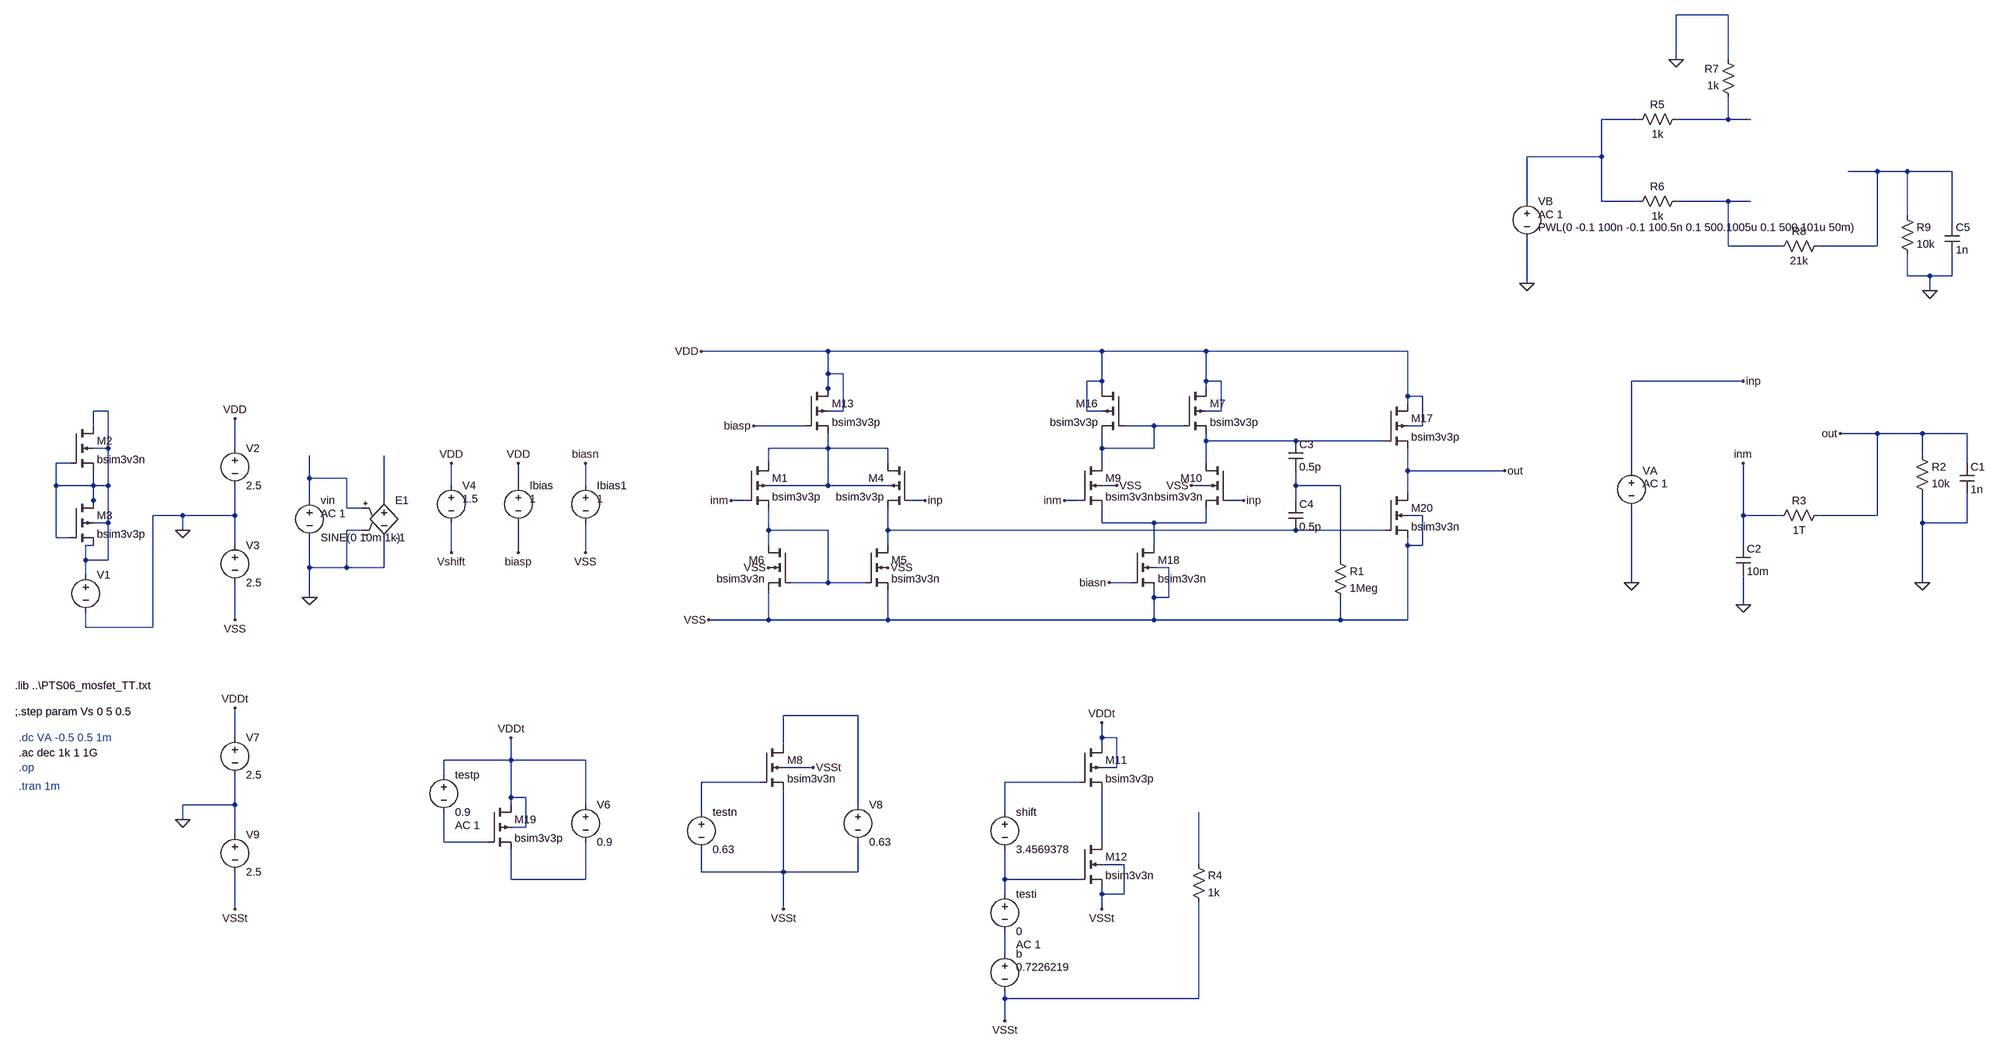
[diagram p0: schematic railtorail.asc]
railtorail.asc, the LTspice schematic file:
Version 4
SHEET 1 4152 812
WIRE 3392 -1520 3280 -1520
WIRE 3280 -1424 3280 -1520
WIRE 3392 -1424 3392 -1520
WIRE 3200 -1296 3120 -1296
WIRE 3392 -1296 3392 -1344
WIRE 3392 -1296 3280 -1296
WIRE 3440 -1296 3392 -1296
WIRE 3120 -1216 3120 -1296
WIRE 3120 -1216 2960 -1216
WIRE 3712 -1184 3648 -1184
WIRE 3776 -1184 3712 -1184
WIRE 3872 -1184 3776 -1184
WIRE 2960 -1120 2960 -1216
WIRE 3120 -1120 3120 -1216
WIRE 3200 -1120 3120 -1120
WIRE 3392 -1120 3280 -1120
WIRE 3440 -1120 3392 -1120
WIRE 3776 -1088 3776 -1184
WIRE 3872 -1072 3872 -1184
WIRE 3392 -1024 3392 -1120
WIRE 3504 -1024 3392 -1024
WIRE 3712 -1024 3712 -1184
WIRE 3712 -1024 3584 -1024
WIRE 3776 -960 3776 -1008
WIRE 3824 -960 3776 -960
WIRE 3872 -960 3872 -1008
WIRE 3872 -960 3824 -960
WIRE 2960 -944 2960 -1040
WIRE 3824 -928 3824 -960
WIRE 1376 -768 1104 -768
WIRE 2048 -768 1376 -768
WIRE 2272 -768 2048 -768
WIRE 2704 -768 2272 -768
WIRE 1376 -720 1376 -768
WIRE 1408 -720 1376 -720
WIRE 2048 -704 2048 -768
WIRE 2048 -704 2016 -704
WIRE 2272 -704 2272 -768
WIRE 2304 -704 2272 -704
WIRE 3424 -704 3184 -704
WIRE 1376 -688 1376 -720
WIRE 2048 -688 2048 -704
WIRE 2272 -688 2272 -704
WIRE 1376 -672 1376 -688
WIRE 2704 -672 2704 -768
WIRE 2736 -672 2704 -672
WIRE 2704 -656 2704 -672
WIRE -320 -640 -352 -640
WIRE 1408 -640 1408 -720
WIRE 1408 -640 1376 -640
WIRE 2016 -640 2016 -704
WIRE 2048 -640 2016 -640
WIRE 2304 -640 2304 -704
WIRE 2304 -640 2272 -640
WIRE -352 -608 -352 -640
WIRE 1328 -608 1216 -608
WIRE 2160 -608 2096 -608
WIRE 2224 -608 2160 -608
WIRE 2736 -608 2736 -672
WIRE 2736 -608 2704 -608
WIRE 3712 -592 3632 -592
WIRE 3808 -592 3712 -592
WIRE 3904 -592 3808 -592
WIRE 2272 -576 2272 -592
WIRE 2464 -576 2272 -576
WIRE 2656 -576 2464 -576
WIRE -320 -560 -320 -640
WIRE -320 -560 -352 -560
WIRE -48 -560 -48 -624
WIRE 1376 -560 1376 -592
WIRE 1376 -560 1248 -560
WIRE 1504 -560 1376 -560
WIRE 2048 -560 2048 -592
WIRE 2160 -560 2160 -608
WIRE 2160 -560 2048 -560
WIRE 3808 -544 3808 -592
WIRE -400 -528 -432 -528
WIRE 1248 -528 1248 -560
WIRE 1504 -528 1504 -560
WIRE 2048 -528 2048 -560
WIRE 2272 -528 2272 -576
WIRE 3904 -528 3904 -592
WIRE 2704 -512 2704 -560
WIRE 2912 -512 2704 -512
WIRE 3184 -512 3184 -704
WIRE 112 -496 112 -544
WIRE 192 -496 112 -496
WIRE -432 -480 -432 -528
WIRE -352 -480 -352 -512
WIRE -352 -480 -432 -480
WIRE -320 -480 -320 -560
WIRE -320 -480 -352 -480
WIRE 416 -480 416 -528
WIRE 560 -480 560 -528
WIRE 704 -480 704 -528
WIRE 1376 -480 1376 -560
WIRE 1376 -480 1248 -480
WIRE 1504 -480 1376 -480
WIRE 2080 -480 2048 -480
WIRE 2272 -480 2240 -480
WIRE 2464 -480 2464 -512
WIRE 2560 -480 2464 -480
WIRE 2704 -464 2704 -512
WIRE -352 -448 -352 -480
WIRE 112 -448 112 -496
WIRE 272 -448 272 -544
WIRE 1200 -448 1168 -448
WIRE 1584 -448 1552 -448
WIRE 2000 -448 1968 -448
WIRE 2352 -448 2320 -448
WIRE 2464 -448 2464 -480
WIRE -352 -432 -352 -448
WIRE 192 -432 192 -496
WIRE 224 -432 192 -432
WIRE -160 -416 -224 -416
WIRE -48 -416 -48 -480
WIRE -48 -416 -160 -416
WIRE 2736 -416 2704 -416
WIRE 3424 -416 3424 -528
WIRE 3504 -416 3424 -416
WIRE 3712 -416 3712 -592
WIRE 3712 -416 3584 -416
WIRE -320 -400 -320 -480
WIRE -320 -400 -352 -400
WIRE 2048 -400 2048 -432
WIRE 2160 -400 2048 -400
WIRE 2272 -400 2272 -432
WIRE 2272 -400 2160 -400
WIRE 3808 -400 3808 -464
WIRE 3904 -400 3904 -464
WIRE 3904 -400 3808 -400
WIRE -160 -384 -160 -416
WIRE 224 -384 192 -384
WIRE 1248 -384 1248 -432
WIRE 1376 -384 1248 -384
WIRE 1504 -384 1504 -432
WIRE 2464 -384 1504 -384
WIRE 2656 -384 2464 -384
WIRE -432 -368 -432 -480
WIRE -400 -368 -432 -368
WIRE -352 -352 -368 -352
WIRE -48 -352 -48 -416
WIRE 1248 -352 1248 -384
WIRE 1504 -352 1504 -384
WIRE 2160 -352 2160 -400
WIRE 2704 -352 2704 -368
WIRE 2736 -352 2736 -416
WIRE 2736 -352 2704 -352
WIRE 3424 -352 3424 -416
WIRE 416 -336 416 -400
WIRE 560 -336 560 -400
WIRE 704 -336 704 -400
WIRE -368 -320 -368 -352
WIRE -320 -320 -320 -400
WIRE -320 -320 -368 -320
WIRE 2560 -320 2560 -480
WIRE 112 -304 112 -368
WIRE 192 -304 192 -384
WIRE 192 -304 112 -304
WIRE 272 -304 272 -368
WIRE 272 -304 192 -304
WIRE 2192 -304 2160 -304
WIRE -368 -288 -368 -320
WIRE 1376 -272 1376 -384
WIRE 1376 -272 1296 -272
WIRE 1456 -272 1376 -272
WIRE 2112 -272 2064 -272
WIRE 3184 -272 3184 -432
WIRE 3808 -272 3808 -400
WIRE 112 -240 112 -304
WIRE 2160 -240 2160 -256
WIRE 2192 -240 2192 -304
WIRE 2192 -240 2160 -240
WIRE 3424 -224 3424 -288
WIRE -48 -192 -48 -272
WIRE 1248 -192 1248 -256
WIRE 1248 -192 1120 -192
WIRE 1504 -192 1504 -256
WIRE 1504 -192 1248 -192
WIRE 2160 -192 2160 -240
WIRE 2160 -192 1504 -192
WIRE 2560 -192 2560 -240
WIRE 2560 -192 2160 -192
WIRE 2704 -192 2704 -352
WIRE 2704 -192 2560 -192
WIRE -368 -176 -368 -208
WIRE -224 -176 -224 -416
WIRE -224 -176 -368 -176
WIRE 1440 48 1280 48
WIRE -48 96 -48 32
WIRE 2048 96 2048 64
WIRE 2080 96 2048 96
WIRE 1280 112 1280 48
WIRE 2048 112 2048 96
WIRE 544 144 544 96
WIRE 544 144 400 144
WIRE 704 144 544 144
WIRE 1344 160 1280 160
WIRE 2080 160 2080 96
WIRE 2080 160 2048 160
WIRE 400 176 400 144
WIRE 1232 192 1104 192
WIRE 2000 192 1840 192
WIRE 544 224 544 144
WIRE 576 224 544 224
WIRE -48 240 -48 176
WIRE -48 240 -160 240
WIRE 544 240 544 224
WIRE 704 240 704 144
WIRE 1440 240 1440 48
WIRE 1104 256 1104 192
WIRE 1840 256 1840 192
WIRE -160 272 -160 240
WIRE 576 288 576 224
WIRE 576 288 544 288
WIRE -48 304 -48 240
WIRE 400 320 400 256
WIRE 496 320 400 320
WIRE 2048 320 2048 208
WIRE 2096 368 2048 368
WIRE 2256 368 2256 256
WIRE 1104 384 1104 336
WIRE 1280 384 1280 208
WIRE 1280 384 1104 384
WIRE 1440 384 1440 320
WIRE 1440 384 1280 384
WIRE 544 400 544 336
WIRE 704 400 704 320
WIRE 704 400 544 400
WIRE 1840 400 1840 336
WIRE 2000 400 1840 400
WIRE 1840 432 1840 400
WIRE 2048 432 2048 416
WIRE 2096 432 2096 368
WIRE 2096 432 2048 432
WIRE -48 464 -48 384
WIRE 1280 464 1280 384
WIRE 2048 464 2048 432
WIRE 1840 560 1840 512
WIRE 1840 656 1840 640
WIRE 2256 656 2256 448
WIRE 2256 656 1840 656
WIRE 1840 704 1840 656
FLAG -160 -384 0
FLAG -48 -192 VSS
FLAG -48 -624 VDD
FLAG 112 -240 0
FLAG 1248 -304 VSS
FLAG 1504 -304 VSS
FLAG 1120 -192 VSS
FLAG 1104 -768 VDD
FLAG 1584 -448 inp
FLAG 1168 -448 inm
FLAG 416 -528 VDD
FLAG 416 -336 Vshift
FLAG 2912 -512 out
FLAG 560 -528 VDD
FLAG 560 -336 biasp
FLAG 1216 -608 biasp
FLAG 2048 464 VSSt
FLAG 2048 64 VDDt
FLAG 1840 704 VSSt
FLAG 2080 -480 VSS
FLAG 2240 -480 VSS
FLAG 704 -336 VSS
FLAG 704 -528 biasn
FLAG 2064 -272 biasn
FLAG 1968 -448 inm
FLAG 2352 -448 inp
FLAG 1344 160 VSSt
FLAG 1280 464 VSSt
FLAG 544 96 VDDt
FLAG 3424 -704 inp
FLAG 3424 -528 inm
FLAG 3632 -592 out
FLAG 3184 -272 0
FLAG 3808 -272 0
FLAG 3424 -224 0
FLAG -160 272 0
FLAG -48 464 VSSt
FLAG -48 32 VDDt
FLAG 3280 -1424 0
FLAG 3824 -928 0
FLAG 2960 -944 0
DATAFLAG 1360 -384 ""
DATAFLAG 1344 -560 ""
DATAFLAG 1648 -384 ""
DATAFLAG 2576 -576 ""
DATAFLAG 2800 -512 ""
DATAFLAG 1696 -192 ""
DATAFLAG 1664 -768 ""
DATAFLAG 2160 -400 ""
SYMBOL nmos4 -400 -608 R0
SYMATTR InstName M2
SYMATTR Value bsim3v3n
SYMATTR Value2 l=0.6u w=1.2u
SYMBOL pmos4 -400 -448 R0
SYMATTR InstName M3
SYMATTR Value bsim3v3p
SYMATTR Value2 l=0.6u w=1.2u
SYMBOL voltage -368 -304 R0
WINDOW 123 0 0 Left 0
WINDOW 39 0 0 Left 0
SYMATTR InstName V1
SYMATTR Value ""
SYMBOL voltage -48 -576 R0
WINDOW 123 0 0 Left 0
WINDOW 39 0 0 Left 0
SYMATTR InstName V2
SYMATTR Value 2.5
SYMBOL voltage -48 -368 R0
WINDOW 123 0 0 Left 0
WINDOW 39 0 0 Left 0
SYMATTR InstName V3
SYMATTR Value 2.5
SYMBOL voltage 112 -464 R0
WINDOW 123 24 44 Left 2
WINDOW 39 0 0 Left 0
SYMATTR Value2 AC 1
SYMATTR InstName vin
SYMATTR Value SINE(0 10m 1k)
SYMBOL e 272 -464 R0
SYMATTR InstName E1
SYMATTR Value -1
SYMBOL voltage 416 -496 R0
WINDOW 123 0 0 Left 0
WINDOW 39 0 0 Left 0
WINDOW 3 24 44 Left 2
SYMATTR Value 1.5
SYMATTR InstName V4
SYMBOL voltage 400 160 R0
WINDOW 123 24 124 Left 2
WINDOW 39 0 0 Left 0
SYMATTR Value2 AC 1
SYMATTR InstName testp
SYMATTR Value 0.9
SYMBOL voltage 704 224 R0
WINDOW 123 0 0 Left 0
WINDOW 39 0 0 Left 0
SYMATTR InstName V6
SYMATTR Value 0.9
SYMBOL voltage 1104 240 R0
WINDOW 123 0 0 Left 0
WINDOW 39 0 0 Left 0
SYMATTR InstName testn
SYMATTR Value 0.63
SYMBOL voltage 1440 224 R0
WINDOW 123 0 0 Left 0
WINDOW 39 0 0 Left 0
SYMATTR InstName V8
SYMATTR Value 0.63
SYMBOL voltage 560 -496 R0
WINDOW 123 0 0 Left 0
WINDOW 39 0 0 Left 0
WINDOW 3 24 44 Left 2
SYMATTR Value 1
SYMATTR InstName Ibias
SYMBOL voltage 1840 240 R0
WINDOW 123 0 0 Left 0
WINDOW 39 0 0 Left 0
SYMATTR InstName shift
SYMATTR Value 3.4569378
SYMBOL voltage 1840 416 R0
WINDOW 123 24 124 Left 2
WINDOW 39 0 0 Left 0
SYMATTR Value2 AC 1
SYMATTR InstName testi
SYMATTR Value 0
SYMBOL voltage 1840 544 R0
WINDOW 123 0 0 Left 0
WINDOW 39 0 0 Left 0
WINDOW 3 24 44 Left 2
SYMATTR Value 0.7226219
SYMATTR InstName b
SYMBOL voltage 704 -496 R0
WINDOW 123 0 0 Left 0
WINDOW 39 0 0 Left 0
WINDOW 3 24 44 Left 2
SYMATTR Value 1
SYMATTR InstName Ibias1
SYMBOL nmos4 2000 -528 R0
SYMATTR InstName M9
SYMATTR Value bsim3v3n
SYMATTR Value2 l=0.6u w=1.2u m=4
SYMBOL nmos4 2320 -528 M0
SYMATTR InstName M10
SYMATTR Value bsim3v3n
SYMATTR Value2 l=0.6u w=1.2u m=4
SYMBOL nmos4 2112 -352 R0
SYMATTR InstName M18
SYMATTR Value bsim3v3n
SYMATTR Value2 l=10u w=1.7u m=2
SYMBOL pmos4 1200 -528 R0
SYMATTR InstName M1
SYMATTR Value bsim3v3p
SYMATTR Value2 l=0.6u w=1.2u m=2
SYMBOL pmos4 1552 -528 M0
SYMATTR InstName M4
SYMATTR Value bsim3v3p
SYMATTR Value2 l=0.6u w=1.2u m=2
SYMBOL pmos4 1328 -688 R0
SYMATTR InstName M13
SYMATTR Value bsim3v3p
SYMATTR Value2 l=1u w=1.3u m=8
SYMBOL res 3600 -432 R90
WINDOW 0 0 56 VBottom 2
WINDOW 3 32 56 VTop 2
SYMATTR InstName R3
SYMATTR Value 1T
SYMBOL res 3792 -560 R0
SYMATTR InstName R2
SYMATTR Value 10k
SYMBOL cap 3888 -528 R0
SYMATTR InstName C1
SYMATTR Value 1n
SYMBOL voltage 3184 -528 R0
WINDOW 123 24 44 Left 2
WINDOW 39 0 0 Left 0
SYMATTR Value2 AC 1
SYMATTR InstName VA
SYMATTR Value ""
SYMBOL cap 3408 -352 R0
SYMATTR InstName C2
SYMATTR Value 10m
SYMBOL res 2240 352 R0
SYMATTR InstName R4
SYMATTR Value 1k
SYMBOL voltage -48 80 R0
WINDOW 123 0 0 Left 0
WINDOW 39 0 0 Left 0
SYMATTR InstName V7
SYMATTR Value 2.5
SYMBOL voltage -48 288 R0
WINDOW 123 0 0 Left 0
WINDOW 39 0 0 Left 0
SYMATTR InstName V9
SYMATTR Value 2.5
SYMBOL nmos4 1232 112 R0
SYMATTR InstName M8
SYMATTR Value bsim3v3n
SYMATTR Value2 l=0.6u w=1.9u m=4
SYMBOL nmos4 1456 -352 R0
SYMATTR InstName M5
SYMATTR Value bsim3v3n
SYMATTR Value2 l=0.6u w=1.9u m=4
SYMBOL nmos4 1296 -352 M0
SYMATTR InstName M6
SYMATTR Value bsim3v3n
SYMATTR Value2 l=0.6u w=1.9u m=4
SYMBOL pmos4 496 240 R0
SYMATTR InstName M19
SYMATTR Value bsim3v3p
SYMATTR Value2 l=0.6u w=1.2u m=8
SYMBOL pmos4 2224 -688 R0
SYMATTR InstName M7
SYMATTR Value bsim3v3p
SYMATTR Value2 l=0.6u w=1.2u m=8
SYMBOL pmos4 2096 -688 M0
SYMATTR InstName M16
SYMATTR Value bsim3v3p
SYMATTR Value2 l=0.6u w=1.2u m=8
SYMBOL cap 2448 -576 R0
SYMATTR InstName C3
SYMATTR Value 0.5p
SYMBOL cap 2448 -448 R0
SYMATTR InstName C4
SYMATTR Value 0.5p
SYMBOL res 2544 -336 R0
SYMATTR InstName R1
SYMATTR Value 1Meg
SYMBOL res 3296 -1312 R90
WINDOW 0 0 56 VBottom 2
WINDOW 3 32 56 VTop 2
SYMATTR InstName R5
SYMATTR Value 1k
SYMBOL res 3296 -1136 R90
WINDOW 0 0 56 VBottom 2
WINDOW 3 32 56 VTop 2
SYMATTR InstName R6
SYMATTR Value 1k
SYMBOL res 3408 -1328 R180
WINDOW 0 36 76 Left 2
WINDOW 3 36 40 Left 2
SYMATTR InstName R7
SYMATTR Value 1k
SYMBOL res 3488 -1008 R270
WINDOW 0 32 56 VTop 2
WINDOW 3 0 56 VBottom 2
SYMATTR InstName R8
SYMATTR Value 21k
SYMBOL res 3760 -1104 R0
SYMATTR InstName R9
SYMATTR Value 10k
SYMBOL cap 3856 -1072 R0
SYMATTR InstName C5
SYMATTR Value 1n
SYMBOL voltage 2960 -1136 R0
WINDOW 123 24 44 Left 2
WINDOW 39 0 0 Left 0
WINDOW 3 24 72 Left 2
SYMATTR Value2 AC 1
SYMATTR InstName VB
SYMATTR Value PWL(0 -0.1 100n -0.1 100.5n 0.1 500.1005u 0.1 500.101u 50m)
SYMBOL pmos4 2656 -656 R0
SYMATTR InstName M17
SYMATTR Value bsim3v3p
SYMATTR Value2 l=0.6u w=3.6u m=8
SYMBOL nmos4 2656 -464 R0
SYMATTR InstName M20
SYMATTR Value bsim3v3n
SYMATTR Value2 l=0.6u w=1.2u m=8
SYMBOL pmos4 2000 112 R0
SYMATTR InstName M11
SYMATTR Value bsim3v3p
SYMATTR Value2 l=0.6u w=3.6u m=8
SYMBOL nmos4 2000 320 R0
SYMATTR InstName M12
SYMATTR Value bsim3v3n
SYMATTR Value2 l=0.6u w=1.2u m=8
TEXT -520 -16 Left 2 !.lib ..\\PTS06_mosfet_TT.txt
TEXT -520 40 Left 2 !;.step param Vs 0 5 0.5
TEXT -512 96 Left 2 ;.dc VA -0.5 0.5 1m
TEXT -512 128 Left 2 !.ac dec 1k 1 1G
TEXT -512 160 Left 2 ;.op
TEXT -512 200 Left 2 ;.tran 1m

The netlist it stands for:
* railtorail.asc
M2 N005 N005 N005 N005 bsim3v3n l=0.6u w=1.2u
M3 N005 N005 N005 N005 bsim3v3p l=0.6u w=1.2u
V1 N005 0
V2 VDD 0 2.5
V3 0 VSS 2.5
vin N009 0 SINE(0 10m 1k) AC 1
E1 N011 0 N009 0 -1
V4 VDD Vshift 1.5
V§testp VDDt N018 0.9 AC 1
V6 VDDt N021 0.9
V§testn N016 VSSt 0.63
V8 N015 VSSt 0.63
V§Ibias VDD biasp 1
V§shift N017 N022 3.4569378
V§testi N022 N023 0 AC 1
V§b N023 VSSt 0.7226219
V§Ibias1 biasn VSS 1
M9 N006 inm N012 VSS bsim3v3n l=0.6u w=1.2u m=4
M10 N007 inp N012 VSS bsim3v3n l=0.6u w=1.2u m=4
M18 N012 biasn VSS VSS bsim3v3n l=10u w=1.7u m=2
M1 N008 inm N013 N008 bsim3v3p l=0.6u w=1.2u m=2
M4 N008 inp N014 N008 bsim3v3p l=0.6u w=1.2u m=2
M13 VDD biasp N008 VDD bsim3v3p l=1u w=1.3u m=8
R3 out inm 1T
R2 out 0 10k
C1 out 0 1n
VA inp 0 AC 1
C2 inm 0 10m
R4 N020 VSSt 1k
V7 VDDt 0 2.5
V9 0 VSSt 2.5
M8 N015 N016 VSSt VSSt bsim3v3n l=0.6u w=1.9u m=4
M5 N014 N013 VSS VSS bsim3v3n l=0.6u w=1.9u m=4
M6 N013 N013 VSS VSS bsim3v3n l=0.6u w=1.9u m=4
M19 VDDt N018 N021 VDDt bsim3v3p l=0.6u w=1.2u m=8
M7 VDD N006 N007 VDD bsim3v3p l=0.6u w=1.2u m=8
M16 VDD N006 N006 VDD bsim3v3p l=0.6u w=1.2u m=8
C3 N007 N010 0.5p
C4 N010 N014 0.5p
R1 N010 VSS 1Meg
R5 N002 N001 1k
R6 N004 N001 1k
R7 N002 0 1k
R8 N004 N003 21k
R9 N003 0 10k
C5 N003 0 1n
VB N001 0 PWL(0 -0.1 100n -0.1 100.5n 0.1 500.1005u 0.1 500.101u 50m) AC 1
M17 VDD N007 out VDD bsim3v3p l=0.6u w=3.6u m=8
M20 out N014 VSS VSS bsim3v3n l=0.6u w=1.2u m=8
M11 VDDt N017 N019 VDDt bsim3v3p l=0.6u w=3.6u m=8
M12 N019 N022 VSSt VSSt bsim3v3n l=0.6u w=1.2u m=8
.model NMOS NMOS
.model PMOS PMOS
.lib standard.mos
.lib ..\PTS06_mosfet_TT.txt
;.step param Vs 0 5 0.5
* .dc VA -0.5 0.5 1m
.ac dec 1k 1 1G
* .op
* .tran 1m
.backanno
.end